# Altium schematic sheet FPGA_165C_SimpleNetworkProtocol.SchDoc
size B; Organization: Altium Limited; Address1: L3, 12a Rodborough Rd; Address2: Frenchs Forest; Address3: NSW; Address4: Australia 2086; DocumentNumber: 2; SheetNumber: 2; SheetTotal: 3
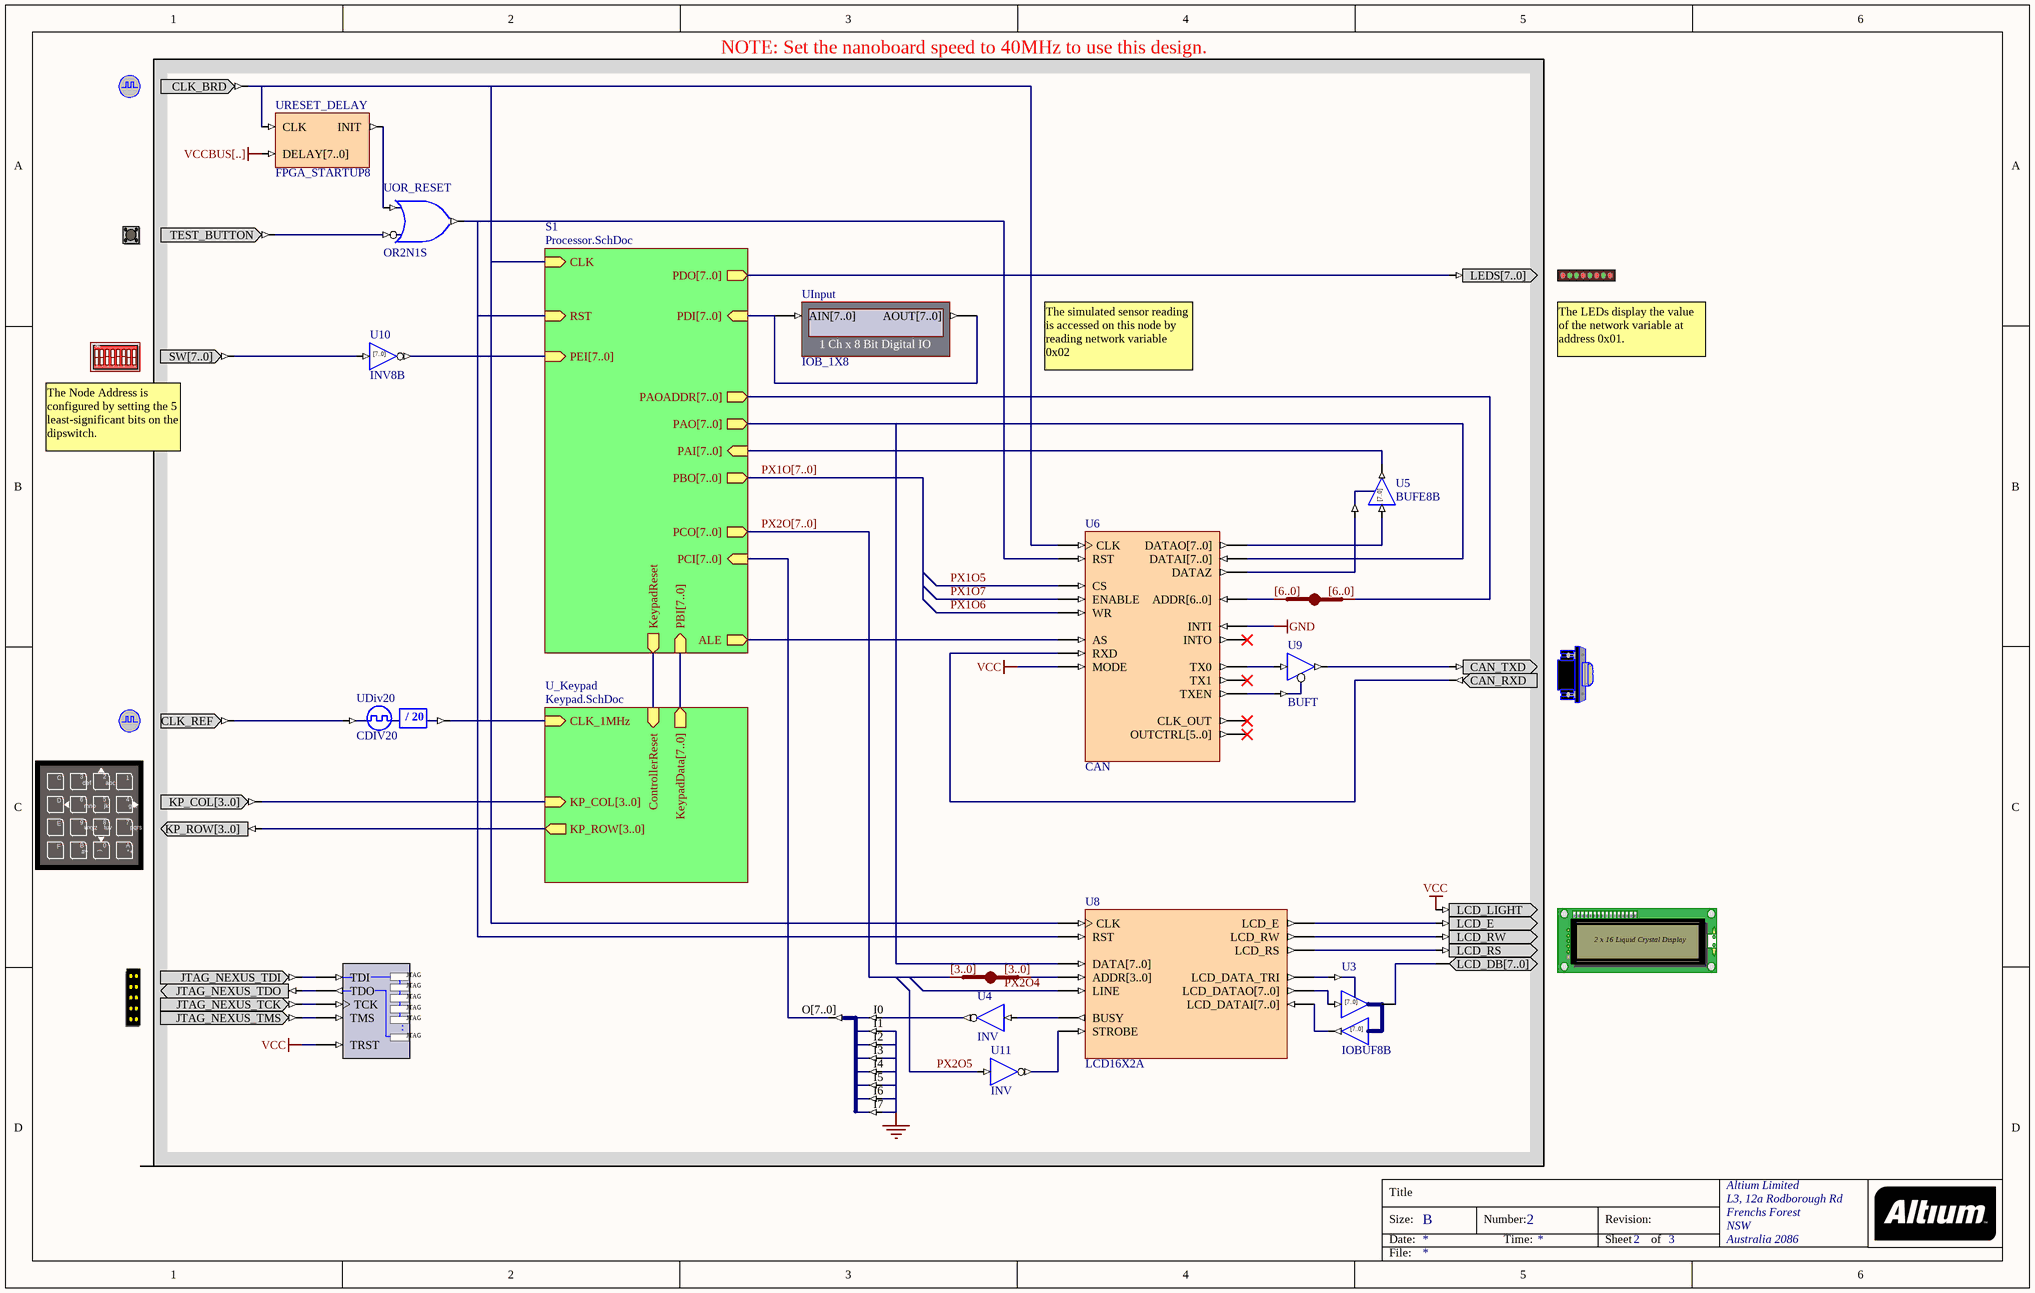
[diagram p0: FPGA_165C_SimpleNetworkProtocol.SchDoc]

## Parts
(Parts that share a designator on the sheet are numbered #1, #2 ... from top to bottom, then left to right.)
?#1  CLOCK_BOARD  (value not drawn)
?#2  TEST_BUTTON  (value not drawn)
?#3  LED  (value not drawn)
?#4  DIPSWITCH  (value not drawn)
?#5  CANCNTR  (value not drawn)
?#6  CLOCK_REFERENCE  (value not drawn)
?#7  KEYPAD  (value not drawn)
?#8  LCD  (value not drawn)
?#9  NEXUS_JTAG_CONNECTOR  (value not drawn)
JB1  IndexA: [6..0]  (hidden comment: JB)
JB2  IndexA: [3..0]  (hidden comment: JB)
NEXUS_JTAG_PORT  NEXUS_JTAG_PORT  (value not drawn)
U3  IOBUF8B
U4  INV
U5  BUFE8B
U6  CAN
U7  J8S_8B  (value not drawn)
U8  LCD16X2A
U9  BUFT
U10  INV8B
U11  INV
UDiv20  CDIV20
UInput  IOB_1X8
UOR_RESET  OR2N1S
URESET_DELAY  FPGA_STARTUP8

## Sub-sheets
S1 = Processor.SchDoc: ALE (out), PAOADDR[7..0] (out), PAI[7..0] (in), PBI[7..0] (in), PCI[7..0] (in), PAO[7..0] (out), PBO[7..0] (out), PCO[7..0] (out), RST (in), CLK (in), PDI[7..0] (in), PEI[7..0] (in), PDO[7..0] (out), KeypadReset (out)
U_Keypad = Keypad.SchDoc: CLK_1MHz (in), ControllerReset (in), KeypadData[7..0] (out), KP_COL[3..0] (in), KP_ROW[3..0] (out)

## Nets
GND: U6.INTI U7.I1 U7.I2 U7.I3 U7.I4 U7.I5 U7.I6 U7.I7
VCC: ?#8.LCD_LIGHT NEXUS_JTAG_PORT.TRST U6.MODE
VCCBUS[..]: URESET_DELAY.DELAY[7..0]
PX1O5: U6.CS
PX1O6: U6.WR
PX1O7: U6.ENABLE
PX2O4: U8.LINE
PX2O5: U11.I
PX2O[7..0]: JB2.A[0..0] ; sheet S1/PCO[7..0]
Net?#1_CLK_BRD: ?#1.CLK_BRD U6.CLK U8.CLK URESET_DELAY.CLK ; sheet S1/CLK
Net?#2_TEST_BUTTON: ?#2.TEST_BUTTON UOR_RESET.I0
Net?#3_LEDS[7..0]: ?#3.LEDS[7..0] ; sheet S1/PDO[7..0]
Net?#4_SW[7..0]: ?#4.SW[7..0] U10.I[7..0]
Net?#5_CAN_RXD: ?#5.CAN_RXD U6.RXD
Net?#5_CAN_TXD: ?#5.CAN_TXD U9.O(Y)
Net?#6_CLK_REF: ?#6.CLK_REF UDiv20.CLKIN
Net?#7_KP_COL[3..0]: ?#7.KP_COL[3..0] ; sheet U_Keypad/KP_COL[3..0]
Net?#7_KP_ROW[3..0]: ?#7.KP_ROW[3..0] ; sheet U_Keypad/KP_ROW[3..0]
Net?#8_LCD_DB[7..0]: ?#8.LCD_DB[7..0] U3.IO[7..0]
Net?#8_LCD_E: ?#8.LCD_E U8.LCD_E
Net?#8_LCD_RS: ?#8.LCD_RS U8.LCD_RS
Net?#8_LCD_RW: ?#8.LCD_RW U8.LCD_RW
Net?#9_JTAG_NEXUS_TCK: ?#9.JTAG_NEXUS_TCK NEXUS_JTAG_PORT.TCK
Net?#9_JTAG_NEXUS_TDI: ?#9.JTAG_NEXUS_TDI NEXUS_JTAG_PORT.TDI
Net?#9_JTAG_NEXUS_TDO: ?#9.JTAG_NEXUS_TDO NEXUS_JTAG_PORT.TDO
Net?#9_JTAG_NEXUS_TMS: ?#9.JTAG_NEXUS_TMS NEXUS_JTAG_PORT.TMS
NetJB1_A[0..0]: JB1.A[0..0] U6.ADDR[6..0]
NetJB1_B[0..0]: JB1.B[0..0] ; sheet S1/PAOADDR[7..0]
NetJB2_B[0..0]: JB2.B[0..0] U8.ADDR[3..0]
NetU3_I[7..0]: U3.I[7..0] U8.LCD_DATAO[7..0]
NetU3_O[7..0]: U3.O[7..0] U8.LCD_DATAI[7..0]
NetU3_T: U3.T U8.LCD_DATA_TRI
NetU4_I: U4.I U8.BUSY
NetU4_O: U4.O U7.I0
NetU5_E: U5.E U6.DATAZ
NetU5_I[7..0]: U5.I[7..0] U6.DATAO[7..0]
NetU5_O[7..0]: U5.O[7..0] ; sheet S1/PAI[7..0]
NetU6_AS: U6.AS ; sheet S1/ALE
NetU6_DATAI[7..0]: U6.DATAI[7..0] U8.DATA[7..0] ; sheet S1/PAO[7..0]
NetU6_RST: U6.RST U8.RST UOR_RESET.O ; sheet S1/RST
NetU6_TX0: U6.TX0 U9.I
NetU6_TXEN: U6.TXEN U9.T
NetU7_O[7..0]: U7.O[7..0] ; sheet S1/PCI[7..0]
NetU8_STROBE: U8.STROBE U11.O
NetU10_O[7..0]: U10.O[7..0] ; sheet S1/PEI[7..0]
NetUDiv20_CLKDV: UDiv20.CLKDV ; sheet U_Keypad/CLK_1MHz
NetUInput_AIN[7..0]: UInput.AIN[7..0] UInput.AOUT[7..0] ; sheet S1/PDI[7..0]
NetUOR_RESET_I1: UOR_RESET.I1 URESET_DELAY.INIT
(unnamed): sheet S1/KeypadReset, sheet U_Keypad/ControllerReset

Not connected (* = marked no-connect by the designer): U6 CLK_OUT* INTO* OUTCTRL[5..0]* TX1*

## Buses and harness runs
bus PX1O[7..0] = sheet S1/PBO[7..0]
bus PX2O[7..0] = sheet S1/PCO[7..0]
bus sheet S1/PBI[7..0] = sheet U_Keypad/KeypadData[7..0]

## Notes on the sheet
- NOTE: Set the nanoboard speed to 40MHz to use this design.
- The simulated sensor reading is accessed on this node by reading network variable 0x02
- The LEDs display the value of the network variable at address 0x01.
- The Node Address is configured by setting the 5 least-significant bits on the dipswitch.
- Title
- Size:
- Date:
- B
- Number:
- Time:
- Revision:
- Sheet
- of
- File:
- (in symbol BUFE8B) [7..0]
- (in symbol CDIV20) / 20
- (in symbol DIPSWITCH) ON; 1; 2; 3; 4; 5; 6; 7; 8
- (in symbol INV8B) [7..0]
- (in symbol IOBUF8B) [7..0]
- (in symbol KEYPAD) C; 3; 2; 1; def; abc; 6; 5; 4; D; mno; jkl; ghi; E; 9; 8; 7; wxyz; tuv; pqrs; F; B; 0; A; #^; (; *+
- (in symbol LCD) 2 x 16 Liquid Crystal Display
- (in symbol NEXUS_JTAG_PORT) JTAG; .

## Library data of the parts
?#1 = CLOCK_BOARD: Global System Clock Supply; PortComponent: True; Published: 19-Nov-2003; Publisher: Altium Limited
?#2 = TEST_BUTTON: Test Button; PortComponent: True; Published: 19-Nov-2003; Publisher: Altium Limited
?#3 = LED: 8-Way LEDS; PortComponent: True; Published: 19-Nov-2003; Publisher: Altium Limited
?#4 = DIPSWITCH: 8-Way Dip Switch; PortComponent: True; Published: 19-Nov-2003; Publisher: Altium Limited
?#5 = CANCNTR: CAN Bus Connector; PortComponent: True; Published: 19-Nov-2003; Publisher: Altium Limited
?#6 = CLOCK_REFERENCE: Global System Clock Reference Supply; PortComponent: True; Published: 19-Nov-2003; Publisher: Altium Limited
?#7 = KEYPAD: Key Pad; PortComponent: True; Published: 19-Nov-2003; Publisher: Altium Limited
?#8 = LCD: Liquid Crystal Display; PortComponent: True; Published: 19-Nov-2003; Publisher: Altium Limited
?#9 = NEXUS_JTAG_CONNECTOR: JTAG Port; PortComponent: True; Published: 19-Nov-2003; Publisher: Altium Limited
JB1 JB2 = JB: System BUS Joiner; ArchiveName: GENERIC; Published: 18-Dec-2003; Publisher: Altium Limited; Core Revision: 1.00.00
  JB1: IndexB: [6..0]
  JB2: IndexB: [3..0]
NEXUS_JTAG_PORT = NEXUS_JTAG_PORT: Soft Nexus-Chain Connector; NEXUS_JTAG_CONNECTOR: True; Published: 18-Dec-2003; Publisher: Altium Limited
U3 = IOBUF8B: 8-Bit Input/Output Buffer, Bus Version; ArchiveName: GENERIC; Published: 18-Dec-2003; Publisher: Altium Limited; Core Revision: 1.00.00
U4 U11 = INV: Inverter; ArchiveName: GENERIC; VHDLIB_SIM: GENERIC_LIB; Published: 28-Jan-2004; Publisher: Altium Limited; Xilinx Equivalent: INV; Core Revision: 1.00.00
U5 = BUFE8B: 8-Bit 3-state Buffer with Active High Enable; Xilinx Equivalent: BUFE8; ArchiveName: GENERIC; Published: 18-Sep-2003; Publisher: Altium Limited; Class I: Buffer
U6 = CAN: CAN Controller; ChildModel1: CAN10000_DRAM8X64; Published: 18/12/2003; Publisher: Altium Hobart Technology Centre; Core Revision: 1.00.00
U7 = J8S_8B: 8 Single pin inputs to single 8-Bit output bus; ArchiveName: GENERIC; Published: 18-Dec-2003; Publisher: Altium Limited; Core Revision: 1.00.00
U8 = LCD16X2A: LCD Controller; Published: 5/01/2004; Publisher: Altium Hobart Technology Centre; Core Revision: 1.00.00
U9 = BUFT: 1-Bit 3-state Buffer with Active Low Enable; ArchiveName: GENERIC; Published: 18-Sep-2003; Publisher: Altium Limited; Class I: Buffer; Xilinx Equivalent: BUFT
U10 = INV8B: 8-Bit Inverter, Bus Version; ArchiveName: GENERIC; Published: 18-Dec-2003; Publisher: Altium Limited; Core Revision: 1.00.00
UDiv20 = CDIV20: Clock Divider by 20; ArchiveName: GENERIC; Published: 18-Dec-2003; Publisher: Altium Limited; Core Revision: 1.00.00
UInput = IOB_1X8: 1 Ch x 8 Bit Digital IO; NEXUS_CORE: Instrument; NEXUS_JTAG_DEVICE: True; NEXUS_JTAG_ORDER: 0; Published: 30/09/2003; Publisher: Altium Hobart Technology Centre; Core Revision: 1.00.00
UOR_RESET = OR2N1S: 2-Input OR Gate with Active Low A Input, Single Pin Version; Xilinx Equivalent: OR2B1; ArchiveName: GENERIC; Published: 18-Dec-2003; Publisher: Altium Limited; Core Revision: 1.00.00
URESET_DELAY = FPGA_STARTUP8: FPGA Startup With 8 Bit Delay; Published: 21/01/2004; Publisher: Altium Hobart Technology Centre; Core Revision: 1.00.00